# Altium schematic sheet D_INPUT.SchDoc
size A4; SheetNumber: 8; SheetTotal: 9
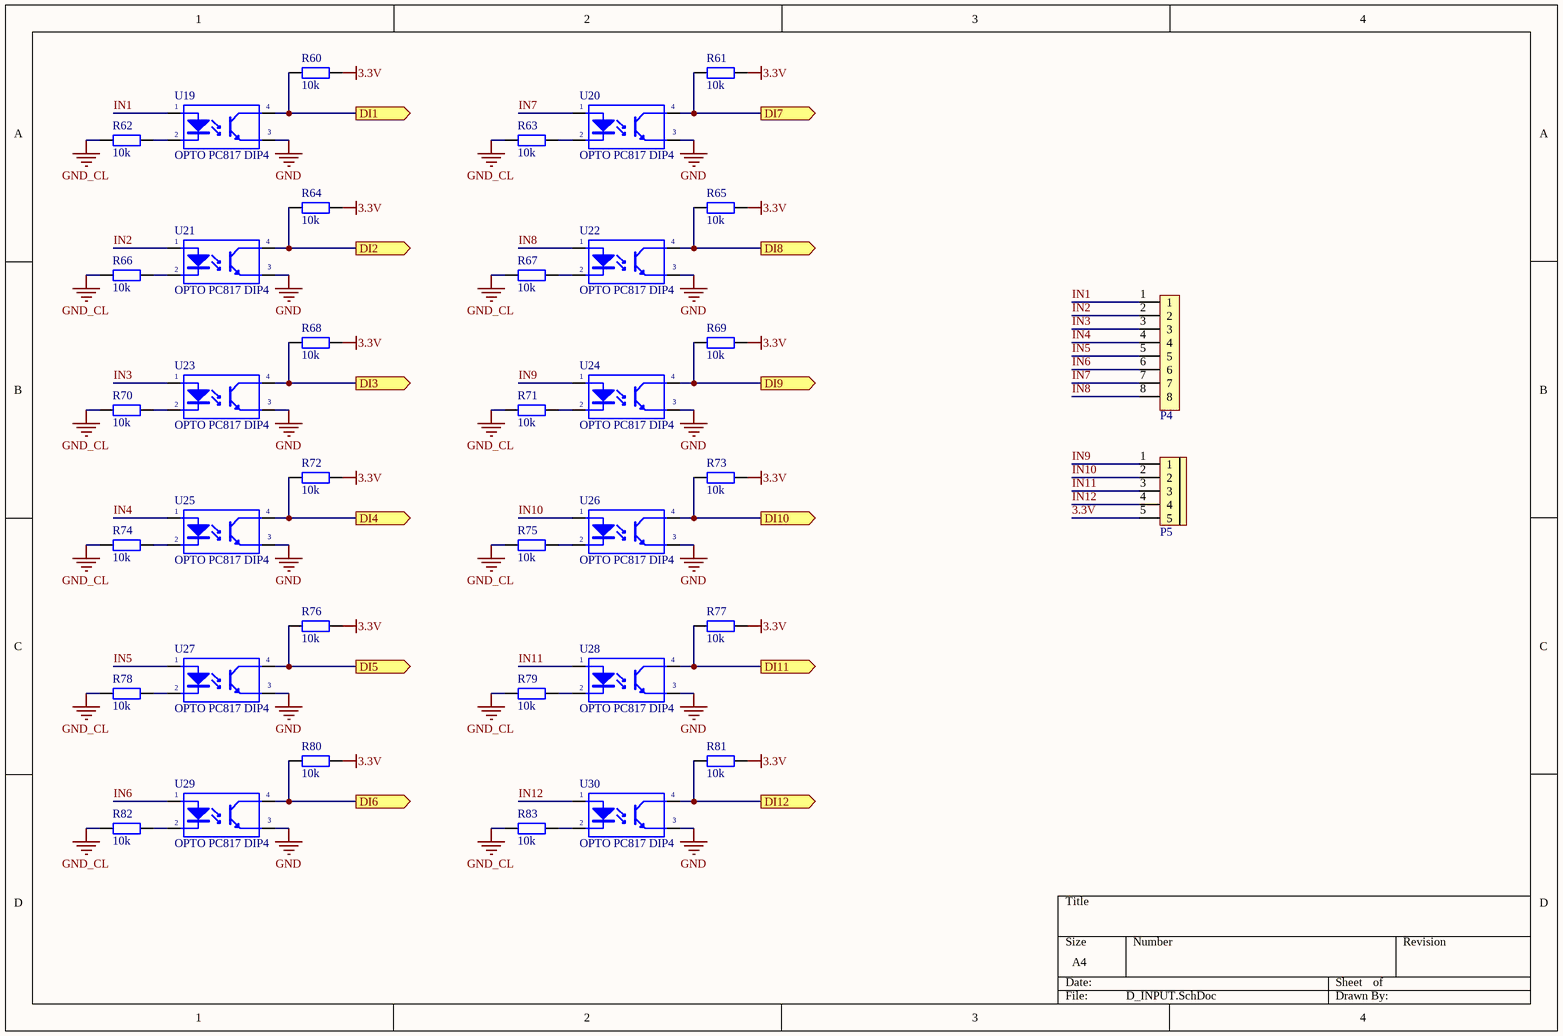
[diagram p0: D_INPUT.SchDoc]

## Parts
P4  CON 8 EDG5.08  [CON 8 8EDG5.08]  (value not drawn)
P5  CON 5 EDG5.08  [CON 5 5EDG5.08]  (value not drawn)
R60  10k  [tro smd 0805]
R61  10k  [tro smd 0805]
R62  10k  [tro smd 0805]
R63  10k  [tro smd 0805]
R64  10k  [tro smd 0805]
R65  10k  [tro smd 0805]
R66  10k  [tro smd 0805]
R67  10k  [tro smd 0805]
R68  10k  [tro smd 0805]
R69  10k  [tro smd 0805]
R70  10k  [tro smd 0805]
R71  10k  [tro smd 0805]
R72  10k  [tro smd 0805]
R73  10k  [tro smd 0805]
R74  10k  [tro smd 0805]
R75  10k  [tro smd 0805]
R76  10k  [tro smd 0805]
R77  10k  [tro smd 0805]
R78  10k  [tro smd 0805]
R79  10k  [tro smd 0805]
R80  10k  [tro smd 0805]
R81  10k  [tro smd 0805]
R82  10k  [tro smd 0805]
R83  10k  [tro smd 0805]
U19  OPTO PC817 DIP4  [DIP4]
U20  OPTO PC817 DIP4  [DIP4]
U21  OPTO PC817 DIP4  [DIP4]
U22  OPTO PC817 DIP4  [DIP4]
U23  OPTO PC817 DIP4  [DIP4]
U24  OPTO PC817 DIP4  [DIP4]
U25  OPTO PC817 DIP4  [DIP4]
U26  OPTO PC817 DIP4  [DIP4]
U27  OPTO PC817 DIP4  [DIP4]
U28  OPTO PC817 DIP4  [DIP4]
U29  OPTO PC817 DIP4  [DIP4]
U30  OPTO PC817 DIP4  [DIP4]

## Ports
DI1 (out), DI2 (out), DI3 (out), DI4 (out), DI5 (out), DI6 (out), DI7 (out), DI8 (out), DI9 (out), DI10 (out), DI11 (out), DI12 (out)

## Nets
3.3V: P5.5 R60.1 R61.1 R64.1 R65.1 R68.1 R69.1 R72.1 R73.1 R76.1 R77.1 R80.1 R81.1
GND: U19.3(E) U20.3(E) U21.3(E) U22.3(E) U23.3(E) U24.3(E) U25.3(E) U26.3(E) U27.3(E) U28.3(E) U29.3(E) U30.3(E)
GND_CL: R62.1 R63.1 R66.1 R67.1 R70.1 R71.1 R74.1 R75.1 R78.1 R79.1 R82.1 R83.1
DI1: R60.2 U19.4(C) ; port DI1
DI2: R64.2 U21.4(C) ; port DI2
DI3: R68.2 U23.4(C) ; port DI3
DI4: R72.2 U25.4(C) ; port DI4
DI5: R76.2 U27.4(C) ; port DI5
DI6: R80.2 U29.4(C) ; port DI6
DI7: R61.2 U20.4(C) ; port DI7
DI8: R65.2 U22.4(C) ; port DI8
DI9: R69.2 U24.4(C) ; port DI9
DI10: R73.2 U26.4(C) ; port DI10
DI11: R77.2 U28.4(C) ; port DI11
DI12: R81.2 U30.4(C) ; port DI12
IN1: P4.1 U19.1(A)
IN2: P4.2 U21.1(A)
IN3: P4.3 U23.1(A)
IN4: P4.4 U25.1(A)
IN5: P4.5 U27.1(A)
IN6: P4.6 U29.1(A)
IN7: P4.7 U20.1(A)
IN8: P4.8 U22.1(A)
IN9: P5.1 U24.1(A)
IN10: P5.2 U26.1(A)
IN11: P5.3 U28.1(A)
IN12: P5.4 U30.1(A)
NetR62_2: R62.2 U19.2(K)
NetR63_2: R63.2 U20.2(K)
NetR66_2: R66.2 U21.2(K)
NetR67_2: R67.2 U22.2(K)
NetR70_2: R70.2 U23.2(K)
NetR71_2: R71.2 U24.2(K)
NetR74_2: R74.2 U25.2(K)
NetR75_2: R75.2 U26.2(K)
NetR78_2: R78.2 U27.2(K)
NetR79_2: R79.2 U28.2(K)
NetR82_2: R82.2 U29.2(K)
NetR83_2: R83.2 U30.2(K)

## Library data of the parts
P4 = CON 8 EDG5.08: Cắm; Ten_Linh_Kien: CON 8 2EDG5.08-8P 5.08MM ( Xanh Cong); Ma_Hang: MH000978; Don_Vi: Con; Ghi_Chu: *; Kieu_Chan: *; Chung_Loai: Cắm
P5 = CON 5 EDG5.08: Cắm; Ten_Linh_Kien: CON 5 2EDG5.08-5P 5.08MM ( Xanh Cong); Ma_Hang: MH003589; Kieu_Chan: *; Don_Vi: Con; Ghi_Chu: *; Chung_Loai: Cắm
R60-R83 = Tro 0805 1% 10k: Dán; Don_Vi: Con; So_Chan: 2; Ten_Linh_Kien: Trở 0805 1% 10k; Ma_Hang: MH005473; Chung_Loai: Dán; Kieu_Chan: *
U19-U30 = OPTO PC817 DIP4: Single Opto; Value: PC817